# Altium schematic sheet Port_Power.SchDoc: Port Power
size 431 x 279 mm; Author: Eric Liu; SheetNumber: 4; SheetTotal: 6
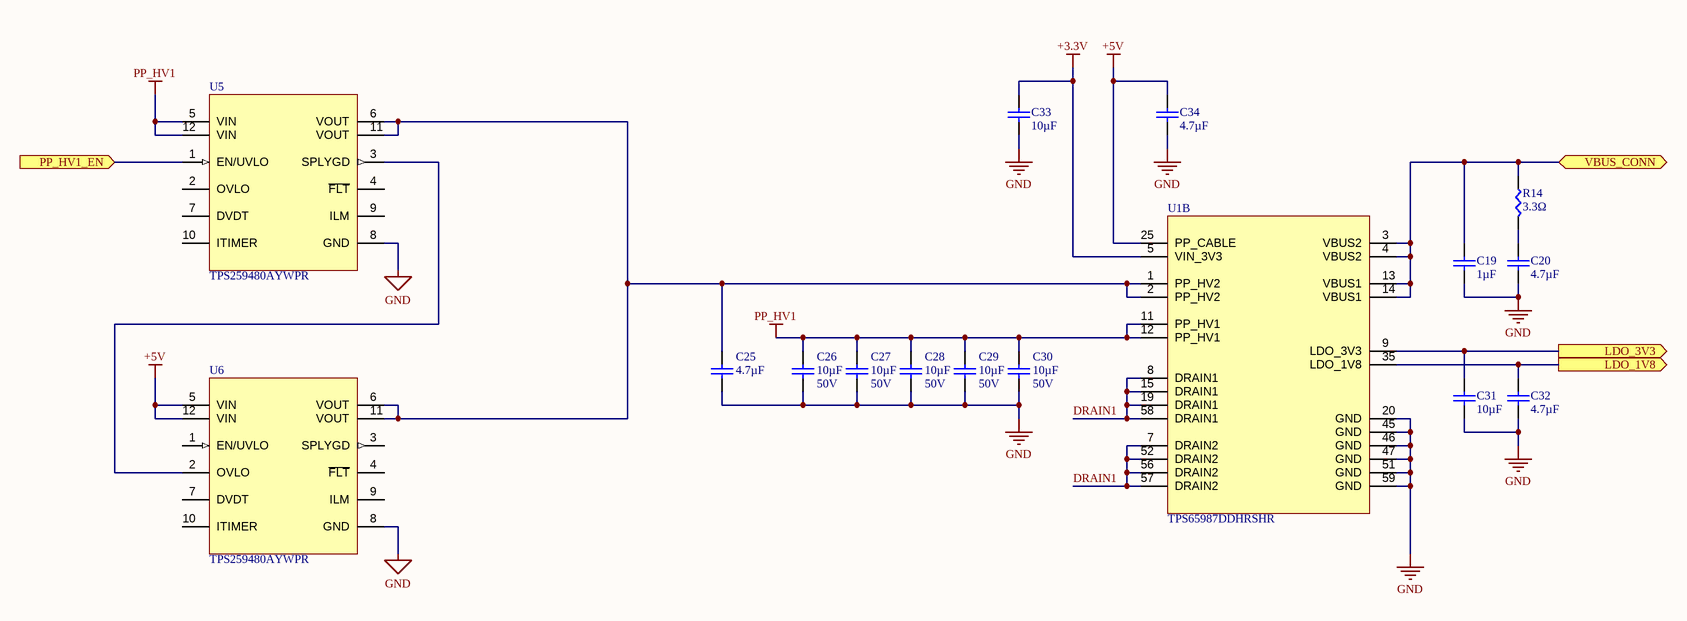
[diagram p0: Port_Power.SchDoc]

## Parts
C19  value 1µF  [CAP0402]  (hidden comment: GRM155R61H105KE05D)
C20  value 4.7µF  [CAP0805]  (hidden comment: GRT21BR61H475KE13L)
C25  value 4.7µF  [CAP0805]  (hidden comment: GRT21BR61H475KE13L)
C26  value 10µF  Voltage: 50V  [CAP1206]  (hidden comment: CL31A106KBHNNNE)
C27  value 10µF  Voltage: 50V  [CAP1206]  (hidden comment: CL31A106KBHNNNE)
C28  value 10µF  Voltage: 50V  [CAP1206]  (hidden comment: CL31A106KBHNNNE)
C29  value 10µF  Voltage: 50V  [CAP1206]  (hidden comment: CL31A106KBHNNNE)
C30  value 10µF  Voltage: 50V  [CAP1206]  (hidden comment: CL31A106KBHNNNE)
C31  value 10µF  [CAP0402]  (hidden comment: CL05A106MQ5NUNC)
C32  value 4.7µF  [CAP0805]  (hidden comment: GRT21BR61H475KE13L)
C33  value 10µF  [CAP0402]  (hidden comment: CL05A106MQ5NUNC)
C34  value 4.7µF  [CAP0805]  (hidden comment: GRT21BR61H475KE13L)
R14  value 3.3Ω  [RES0402]  (hidden comment: ESR10EZPJ3R3)
U1  TPS65987DDHRSHR  [56-VQFN (7x7)]  (part B of 2)
U5  TPS259480AYWPR
U6  TPS259480AYWPR

## Ports
LDO_1V8 (out), LDO_3V3 (out), PP_HV1_EN (in), VBUS_CONN (bidir)

## Nets
+3.3V: C33.2 U1.5(VIN_3V3)
+5V: C34.2 U1.25(PP_CABLE) U6.5(VIN) U6.12(VIN)
GND: C19.1 C20.1 C25.2 C26.1 C27.1 C28.1 C29.1 C30.1 C31.1 C32.1 C33.1 C34.1 U1.20(GND) U1.45(GND) U1.46(GND) U1.47(GND) U1.51(GND) U1.59(GND) U5.8(GND) U6.8(GND)
PP_HV1: C26.2 C27.2 C28.2 C29.2 C30.2 U1.11(PP_HV1) U1.12(PP_HV1) U5.5(VIN) U5.12(VIN)
DRAIN1: U1.7(DRAIN2) U1.8(DRAIN1) U1.15(DRAIN1) U1.19(DRAIN1) U1.52(DRAIN2) U1.56(DRAIN2) U1.57(DRAIN2) U1.58(DRAIN1)
LDO_1V8: C32.2 U1.35(LDO_1V8) ; port LDO_1V8
LDO_3V3: C31.2 U1.9(LDO_3V3) ; port LDO_3V3
PP_HV1_EN: U5.1(EN/UVLO) ; port PP_HV1_EN
VBUS_CONN: C19.2 R14.2 U1.3(VBUS2) U1.4(VBUS2) U1.13(VBUS1) U1.14(VBUS1) ; port VBUS_CONN
NetC20_2: C20.2 R14.1
NetC25_1: C25.1 U1.1(PP_HV2) U1.2(PP_HV2) U5.6(VOUT) U5.11(VOUT) U6.6(VOUT) U6.11(VOUT)
NetU5_3: U5.3(SPLYGD) U6.2(OVLO)

Not connected (* = marked no-connect by the designer): U5 2(OVLO) 4(~{FLT}) 7(DVDT) 9(ILM) 10(ITIMER); U6 1(EN/UVLO) 3(SPLYGD) 4(~{FLT}) 7(DVDT) 9(ILM) 10(ITIMER)

## Notes on the sheet
- DWG. NO.
- REV.
- SHT.
- THIS DOCUMENT AND THE DATA DISCLOSED HEREIN OR HEREWITH IS THE PROPERTY OF ALTIUM LIMITED AND MAY BE FREELY DISTRIBUTED IN WHOLE. NO RIGHTS ARE RESERVED OR EXPRESS OR IMPLIED WARANTEE GIVEN.
- REVISION
- DESCRIPTION
- DATE
- APPROVED
- ENG:
- APPROVALS
- PROJECT
- DSN:
- CHK:
- REFERENCE DOCUMENTS
- PROJECT REVISION:
- TITLE
- DOCUMENT REVISION:
- DESIGN ITEM:
- BOM:
- FAB DWG:
- PCB DWG:
- ASSY DWG:
- SCALE:
- SIZE
- B
- CAGE CODE
- FILE NAME
- DWG NO.
- SHEET
- OF
- REV

## Library data of the parts
C19 = GRM155R61H105KE05D: 1 µF ±10% 50V Ceramic Capacitor X5R 0402 (1005 Metric); Temperature Coefficient: X5R; Package: 0402 (1005 Metric); Voltage: 50V
C20 C25 C32 C34 = GRT21BR61H475KE13L: 4.7 µF ±10% 50V Ceramic Capacitor X5R 0805 (2012 Metric); Temperature Coefficient: X5R; Package: 0402 (1005 Metric); Voltage: 50V
C26-C30 = CL31A106KBHNNNE: 10 µF ±10% 50V Ceramic Capacitor X5R 1206 (3216 Metric); Temperature Coefficient: X5R; Package: 0402 (1005 Metric)
C31 C33 = CL05A106MQ5NUNC: 10 µF ±20% 6.3V Ceramic Capacitor X5R 0402 (1005 Metric); Temperature Coefficient: C0G, NP0; Package: 0402 (1005 Metric); Voltage: 6.3V
R14 = ESR10EZPJ3R3: 3.3 Ohms ±5% 0.5W, 1/2W Chip Resistor 0805 (2012 Metric) Automotive AEC-Q200, Pulse Withstanding Thick Film; Manufacturer 1: Rohm Semiconductor; Manufacturer Part Number 1: ESR10EZPJ3R3; Supplier Part Number 1: RHM3.3KCT-ND; Supplier 1: Digi-Key; Power Rating: 1/2W
U1 = TPS65987DDHRSHR: USB, Type-C Controller PMIC 56-VQFN (7x7); Manufacturer: Texas Instruments; Standards: USB4 PD 3.0; Manufacturer Product Number: TPS65987DDHRSHR; Supplier: DigiKey; Supplier Part Number: 296-52067-1-ND; Datasheet: https://www.ti.com/lit/ds/symlink/tps65987d.pdf?HQS=dis-dk-null-digikeymode-dsf-pf-null-wwe&ts=1769374030059; Operating Temperature: -10°C ~ 75°C
U5 U6 = TPS259480AYWPR: Electronic Fuse Regulator High-Side 8A 12-DSBGA (2.43x1.74); Manufacturer: Texas Instruments; Manufacturer Product Number: TPS259480AYWPR; Supplier: DigiKey; Supplier Part Number: 296-TPS259480AYWPRCT-ND; Datasheet: https://www.ti.com/lit/ds/symlink/tps25948.pdf?ts=1769684043287; Operating Temperature: -40°C ~ 125°C